# Altium schematic sheet MicroSDCard.SchDoc
size A4; Revision: C.2(PCB.SCH)
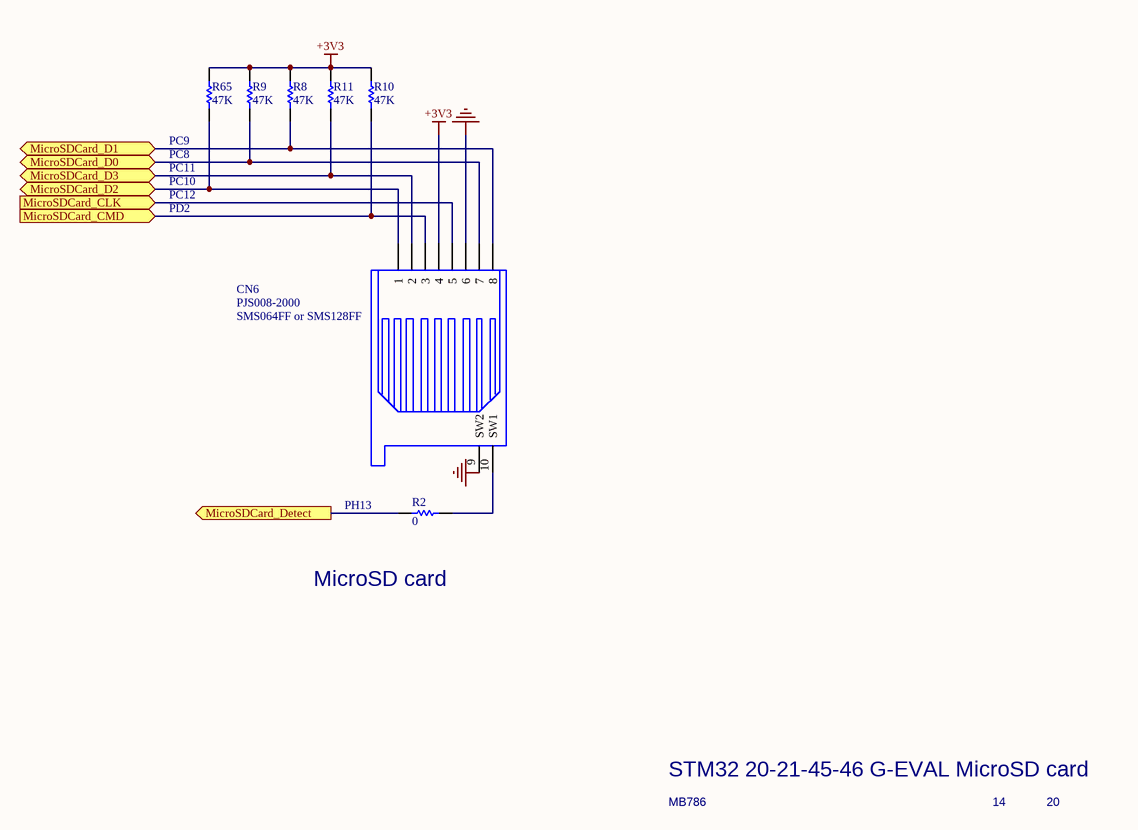
[diagram p0: MicroSDCard.SchDoc]

## Parts
CN6  PJS008-2000  [MSD(PJS008)]
R2  0  [0603R]
R8  47K  [0402R]
R9  47K  [0402R]
R10  47K  [0402R]
R11  47K  [0402R]
R65  47K  [0402R]

## Ports
MicroSDCard_CLK (in), MicroSDCard_CMD (in), MicroSDCard_D0 (bidir), MicroSDCard_D1 (bidir), MicroSDCard_D2 (bidir), MicroSDCard_D3 (bidir), MicroSDCard_Detect (out)

## Nets
+3V3: CN6.4 R8.1 R9.1 R10.1 R11.1 R65.1
GND: CN6.6 CN6.9(SW2)
MicroSDCard_CLK: CN6.5 ; port MicroSDCard_CLK
MicroSDCard_CMD: CN6.3 R10.2 ; port MicroSDCard_CMD
MicroSDCard_D0: CN6.7 R9.2 ; port MicroSDCard_D0
MicroSDCard_D1: CN6.8 R8.2 ; port MicroSDCard_D1
MicroSDCard_D2: CN6.1 R65.2 ; port MicroSDCard_D2
MicroSDCard_D3: CN6.2 R11.2 ; port MicroSDCard_D3
MicroSDCard_Detect: R2.1 ; port MicroSDCard_Detect
NetCN6_10: CN6.10(SW1) R2.2

## Notes on the sheet
- (near R65) PC8
- (near R65) PC9
- PC10
- PC11
- PC12
- PD2
- (near CN6) SMS064FF or SMS128FF
- PH13
- MicroSD card
- STM32 20-21-45-46 G-EVAL MicroSD card
- MB786
- 14
- 20
- STMicroelectronics
- Title:
- Number:
- Rev:
- Date:
- Sheet       of

## Library data of the parts
CN6 = SMS016AFA5E
R2 R8-R11 R65 = Res1: Resistor; Value: 1K; Published: 8-Jun-2000; Revision: July-2002: Re-released for DXP Platform.; Publisher: Altium Limited